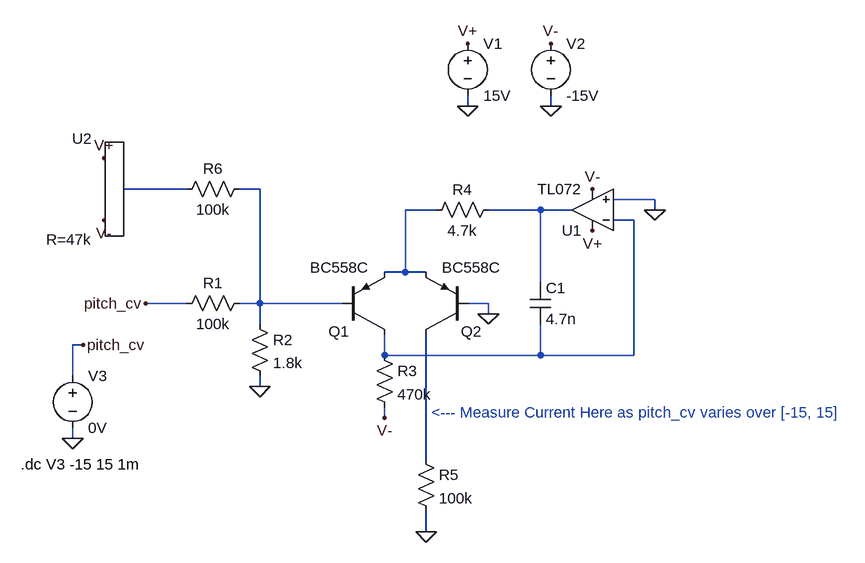
[diagram p0: schematic exp_converter.asc]
exp_converter.asc, the LTspice schematic file:
Version 4
SHEET 1 928 680
WIRE 288 -144 288 -160
WIRE 416 -144 416 -160
WIRE -144 -16 -240 -16
WIRE -32 -16 -64 -16
WIRE 576 0 512 0
WIRE 240 16 192 16
WIRE 400 16 320 16
WIRE 448 16 400 16
WIRE 576 16 576 0
WIRE 544 32 512 32
WIRE 192 112 192 16
WIRE 192 112 160 112
WIRE 224 112 192 112
WIRE 400 128 400 16
WIRE -144 160 -208 160
WIRE -32 160 -32 -16
WIRE -32 160 -64 160
WIRE 96 160 -32 160
WIRE 320 160 288 160
WIRE 320 176 320 160
WIRE -32 192 -32 160
WIRE -304 224 -320 224
WIRE 160 240 160 208
WIRE 400 240 400 192
WIRE 400 240 160 240
WIRE 544 240 544 32
WIRE 544 240 400 240
WIRE -320 272 -320 224
WIRE -32 288 -32 272
WIRE 160 336 160 320
WIRE -320 368 -320 352
WIRE 224 400 224 208
WIRE 224 512 224 480
FLAG -208 160 pitch_cv
FLAG -32 288 0
FLAG 160 336 V-
FLAG 320 176 0
FLAG 576 16 0
FLAG 480 -16 V-
FLAG 480 48 V+
FLAG 288 -144 0
FLAG 416 -144 0
FLAG 288 -240 V+
FLAG 416 -240 V-
FLAG 224 512 0
FLAG -320 368 0
FLAG -304 224 pitch_cv
FLAG -272 -64 V+
FLAG -272 32 V-
SYMBOL res -48 144 R90
WINDOW 0 0 56 VBottom 2
WINDOW 3 32 56 VTop 2
SYMATTR InstName R1
SYMATTR Value 100k
SYMBOL res -48 176 R0
SYMATTR InstName R2
SYMATTR Value 1.8k
SYMBOL pnp 96 208 M180
WINDOW 0 -22 5 Left 2
WINDOW 3 -51 103 Left 2
SYMATTR InstName Q1
SYMATTR Value BC558C
SYMBOL pnp 288 208 R180
WINDOW 0 -22 5 Left 2
WINDOW 3 -51 103 Left 2
SYMATTR InstName Q2
SYMATTR Value BC558C
SYMBOL res 144 224 R0
SYMATTR InstName R3
SYMATTR Value 470k
SYMBOL res 336 0 R90
WINDOW 0 0 56 VBottom 2
WINDOW 3 32 56 VTop 2
SYMATTR InstName R4
SYMATTR Value 4.7k
SYMBOL EXTRA\\AudioOpamp\\TI\\TL072 480 16 R180
SYMATTR InstName U1
SYMBOL cap 384 128 R0
SYMATTR InstName C1
SYMATTR Value 4.7n
SYMBOL voltage 288 -256 R0
WINDOW 123 0 0 Left 0
WINDOW 39 0 0 Left 0
SYMATTR InstName V1
SYMATTR Value 15V
SYMBOL voltage 416 -256 R0
WINDOW 123 0 0 Left 0
WINDOW 39 0 0 Left 0
SYMATTR InstName V2
SYMATTR Value -15V
SYMBOL res 208 384 R0
SYMATTR InstName R5
SYMATTR Value 100k
SYMBOL voltage -320 256 R0
SYMATTR InstName V3
SYMATTR Value 0V
SYMBOL res -48 -32 R90
WINDOW 0 0 56 VBottom 2
WINDOW 3 32 56 VTop 2
SYMATTR InstName R6
SYMATTR Value 100k
SYMBOL EXTRA\\Misc\\pot -272 -16 M0
SYMATTR InstName U2
SYMATTR Value R=47k
SYMATTR Value2 T=0.1
TEXT 232 328 Left 2 ;<--- Measure Current Here as pitch_cv varies over [-15, 15]
TEXT -400 408 Left 2 !.dc V3 -15 15 1m

The netlist it stands for:
* exp_converter.asc
R1 N002 pitch_cv 100k
R2 N002 0 1.8k
Q1 N005 N002 N003 0 BC558C
Q2 N006 0 N003 0 BC558C
R3 N005 V- 470k
R4 N004 N003 4.7k
* U1: TL072 (symbol EXTRA\AudioOpamp\TI\TL072 not available, pins judged from their places): In+=0 In-=N005 V+=V+ V-=V- OUT=N004
C1 N004 N005 4.7n
V1 V+ 0 15V
V2 V- 0 -15V
R5 N006 0 100k
V3 pitch_cv 0 0V
R6 N002 N001 100k
XU2 V+ V- N001 R=47k T=0.1
.model NPN NPN
.model PNP PNP
.lib standard.bjt
* <--- Measure Current Here as pitch_cv varies over [-15, 15]
.dc V3 -15 15 1m
.lib POT.lib
.backanno
.end